# EAGLE design Alice3 (EAGLE 6.5.0)
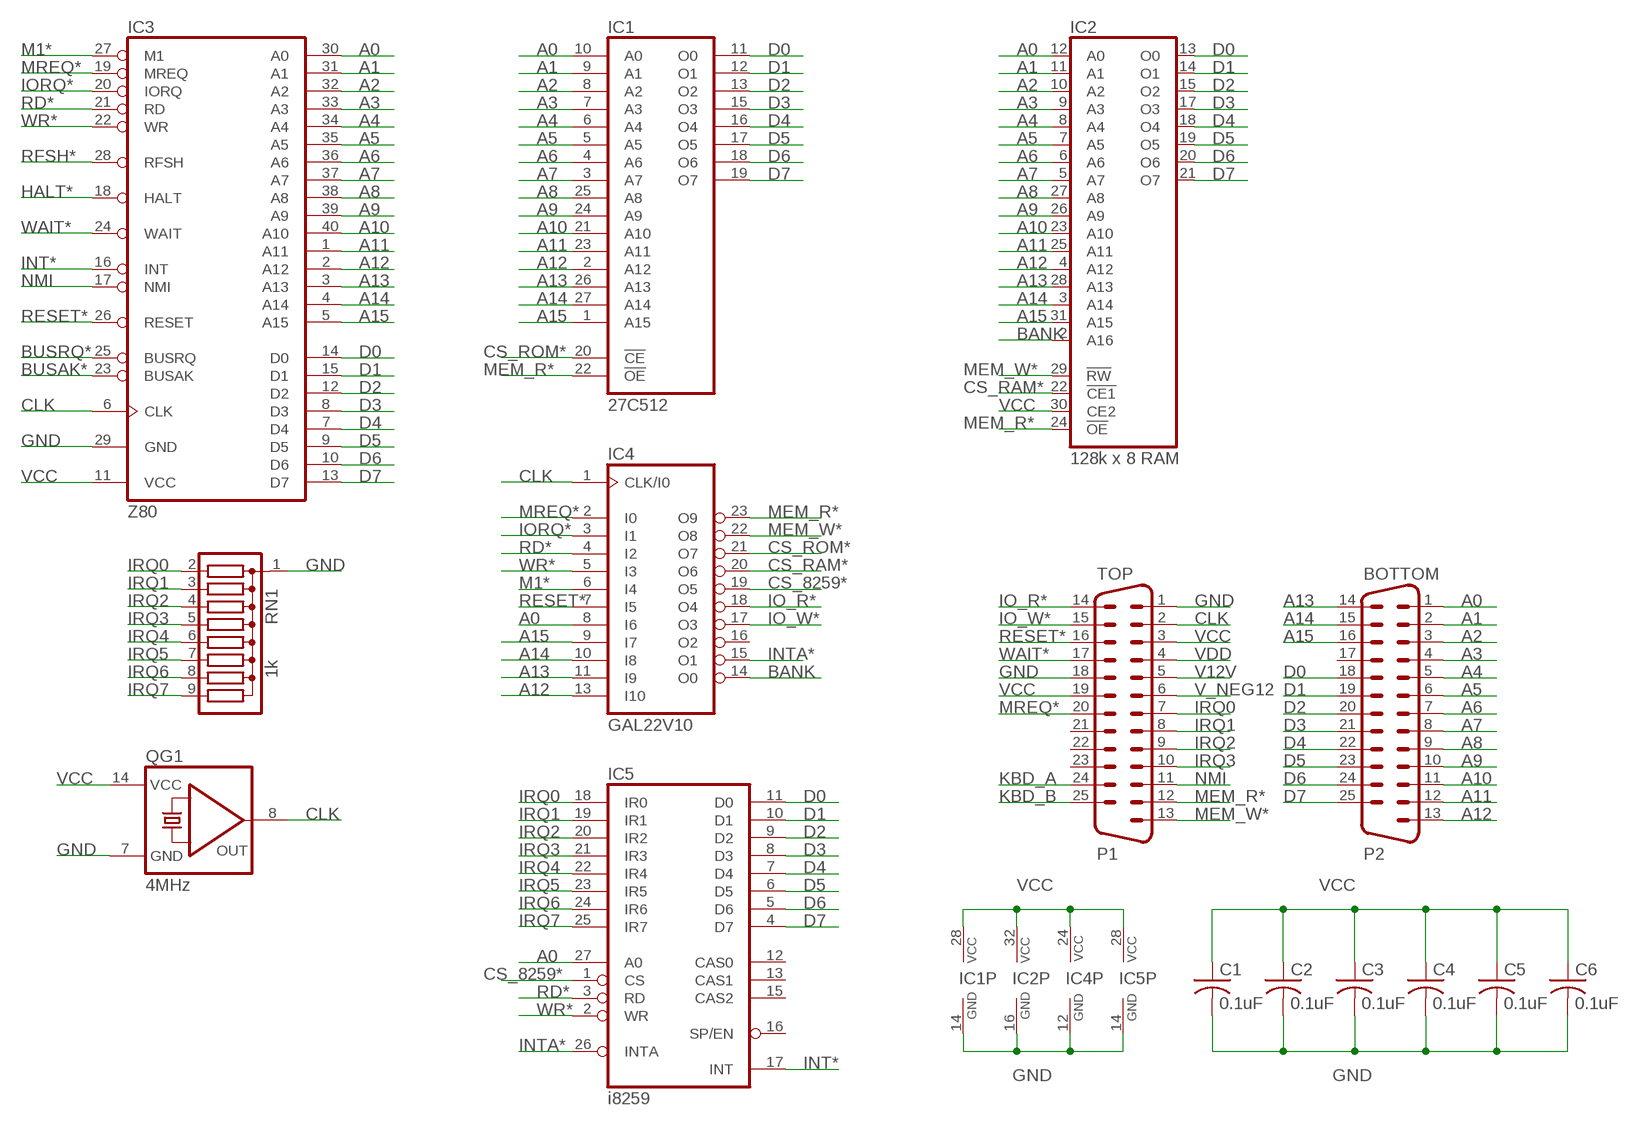
[diagram p0: schematic, sheet 1]

## Parts
BOTTOM  P2  DB25HP  [M25HP]
C1  0.1uF  C-USC1206  [C1206]
C2  0.1uF  C-USC1206  [C1206]
C3  0.1uF  C-USC1206  [C1206]
C4  0.1uF  C-USC1206  [C1206]
C5  0.1uF  C-USC1206  [C1206]
C6  0.1uF  C-USC1206  [C1206]
IC1  27C512  27512  [DIL28]
IC2  128k x 8 RAM  TC551001CP  [DIL32]
IC3  Z80  Z80CPU  [DIL40]
IC4  GAL22V10  22V10  [DIL24-3]
IC5  i8259  8259A  [DIL28-6]
QG1  4MHz  QG5860  [DIL14S]
RN1  1k  G08R  [SIL9]
TOP  P1  DB25HP  [M25HP]

## Nets
A0: BOTTOM.1 IC1.10(A0) IC2.12(A0) IC3.30(A0) IC4.8(I6) IC5.27(A0)
A1: BOTTOM.2 IC1.9(A1) IC2.11(A1) IC3.31(A1)
A2: BOTTOM.3 IC1.8(A2) IC2.10(A2) IC3.32(A2)
A3: BOTTOM.4 IC1.7(A3) IC2.9(A3) IC3.33(A3)
A4: BOTTOM.5 IC1.6(A4) IC2.8(A4) IC3.34(A4)
A5: BOTTOM.6 IC1.5(A5) IC2.7(A5) IC3.35(A5)
A6: BOTTOM.7 IC1.4(A6) IC2.6(A6) IC3.36(A6)
A7: BOTTOM.8 IC1.3(A7) IC2.5(A7) IC3.37(A7)
A8: BOTTOM.9 IC1.25(A8) IC2.27(A8) IC3.38(A8)
A9: BOTTOM.10 IC1.24(A9) IC2.26(A9) IC3.39(A9)
A10: BOTTOM.11 IC1.21(A10) IC2.23(A10) IC3.40(A10)
A11: BOTTOM.12 IC1.23(A11) IC2.25(A11) IC3.1(A11)
A12: BOTTOM.13 IC1.2(A12) IC2.4(A12) IC3.2(A12) IC4.13(I10)
A13: BOTTOM.14 IC1.26(A13) IC2.28(A13) IC3.3(A13) IC4.11(I9)
A14: BOTTOM.15 IC1.27(A14) IC2.3(A14) IC3.4(A14) IC4.10(I8)
A15: BOTTOM.16 IC1.1(A15) IC2.31(A15) IC3.5(A15) IC4.9(I7)
BANK: IC2.2(A16) IC4.14(O0)
BUSAK*: IC3.23(BUSAK)
BUSRQ*: IC3.25(BUSRQ)
CLK: IC3.6(CLK) IC4.1(CLK/I0) QG1.8(OUT) TOP.2
CS_8259*: IC4.19(O5) IC5.1(CS)
CS_RAM*: IC2.22(!CE1) IC4.20(O6)
CS_ROM*: IC1.20(!CE) IC4.21(O7)
D0: BOTTOM.18 IC1.11(O0) IC2.13(O0) IC3.14(D0) IC5.11(D0)
D1: BOTTOM.19 IC1.12(O1) IC2.14(O1) IC3.15(D1) IC5.10(D1)
D2: BOTTOM.20 IC1.13(O2) IC2.15(O2) IC3.12(D2) IC5.9(D2)
D3: BOTTOM.21 IC1.15(O3) IC2.17(O3) IC3.8(D3) IC5.8(D3)
D4: BOTTOM.22 IC1.16(O4) IC2.18(O4) IC3.7(D4) IC5.7(D4)
D5: BOTTOM.23 IC1.17(O5) IC2.19(O5) IC3.9(D5) IC5.6(D5)
D6: BOTTOM.24 IC1.18(O6) IC2.20(O6) IC3.10(D6) IC5.5(D6)
D7: BOTTOM.25 IC1.19(O7) IC2.21(O7) IC3.13(D7) IC5.4(D7)
GND: C1.2 C2.2 C3.2 C4.2 C5.2 C6.2 IC1.14(GND) IC2.16(GND) IC3.29(GND) IC4.12(GND) IC5.14(GND) QG1.7(GND) RN1.1 TOP.1 TOP.18
HALT*: IC3.18(HALT)
INT*: IC3.16(INT) IC5.17(INT)
INTA*: IC4.15(O1) IC5.26(INTA)
IO_R*: IC4.18(O4) TOP.14
IO_W*: IC4.17(O3) TOP.15
IORQ*: IC3.20(IORQ) IC4.3(I1)
IRQ0: IC5.18(IR0) RN1.2 TOP.7
IRQ1: IC5.19(IR1) RN1.3 TOP.8
IRQ2: IC5.20(IR2) RN1.4 TOP.9
IRQ3: IC5.21(IR3) RN1.5 TOP.10
IRQ4: IC5.22(IR4) RN1.6
IRQ5: IC5.23(IR5) RN1.7
IRQ6: IC5.24(IR6) RN1.8
IRQ7: IC5.25(IR7) RN1.9
KBD_A: TOP.24
KBD_B: TOP.25
M1*: IC3.27(M1) IC4.6(I4)
MEM_R*: IC1.22(!OE) IC2.24(!OE) IC4.23(O9) TOP.12
MEM_W*: IC2.29(!RW) IC4.22(O8) TOP.13
MREQ*: IC3.19(MREQ) IC4.2(I0) TOP.20
NMI: IC3.17(NMI) TOP.11
RD*: IC3.21(RD) IC4.4(I2) IC5.3(RD)
RESET*: IC3.26(RESET) IC4.7(I5) TOP.16
RFSH*: IC3.28(RFSH)
V12V: TOP.5
V_NEG12: TOP.6
VCC: C1.1 C2.1 C3.1 C4.1 C5.1 C6.1 IC1.28(VCC) IC2.30(CE2) IC2.32(VCC) IC3.11(VCC) IC4.24(VCC) IC5.28(VCC) QG1.14(VCC) TOP.3 TOP.19
VDD: TOP.4
WAIT*: IC3.24(WAIT) TOP.17
WR*: IC3.22(WR) IC4.5(I3) IC5.2(WR)
Unconnected: BOTTOM.17 IC2.1(NC) IC4.16(O2) IC5.12(CAS0) IC5.13(CAS1) IC5.15(CAS2) IC5.16(SP/EN) TOP.21 TOP.22 TOP.23

## Library data of the parts
BOTTOM TOP = SparkFun-Connectors:DB25: Various DB25 connectors
C1-C6 = resistor:C-US: CAPACITOR, American symbol
IC1 = memory:27512: MEMORY
IC2 = memory:TC551001CP: MEMORY
IC3 = zilog:Z80CPU: Z80 FAMILY DEVICE
IC4 = pal:22V10: PAL; MPN: GAL22V10D-7LPN; OC_FARNELL: 1571925; OC_NEWARK: 97M0480
IC5 = micro-intel:8259A: MICROCOMPUTER/PERIPHERAL DEVICE; OC_FARNELL: unknown; OC_NEWARK: unknown
QG1 = crystal:QG5860: CRYSTAL RESONATOR; OC_FARNELL: unknown; OC_NEWARK: unknown
RN1 = resistor-sil:G08R: SIL RESISTOR; OC_FARNELL: unknown; OC_NEWARK: unknown

## Board
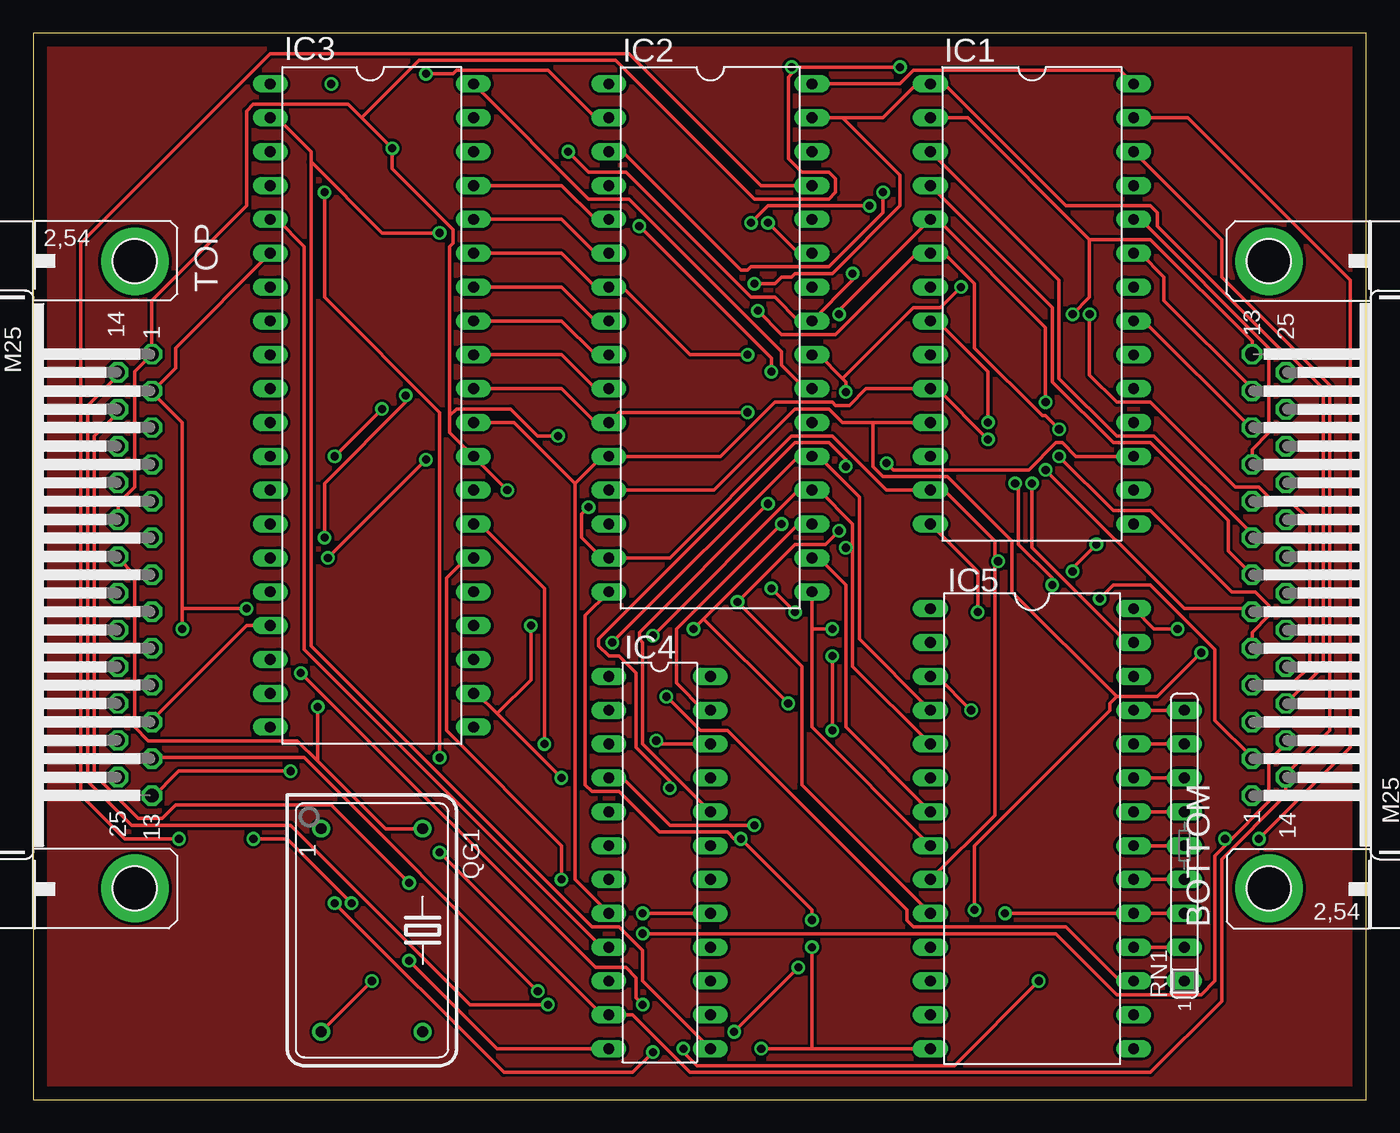
[diagram p1: board, top side]
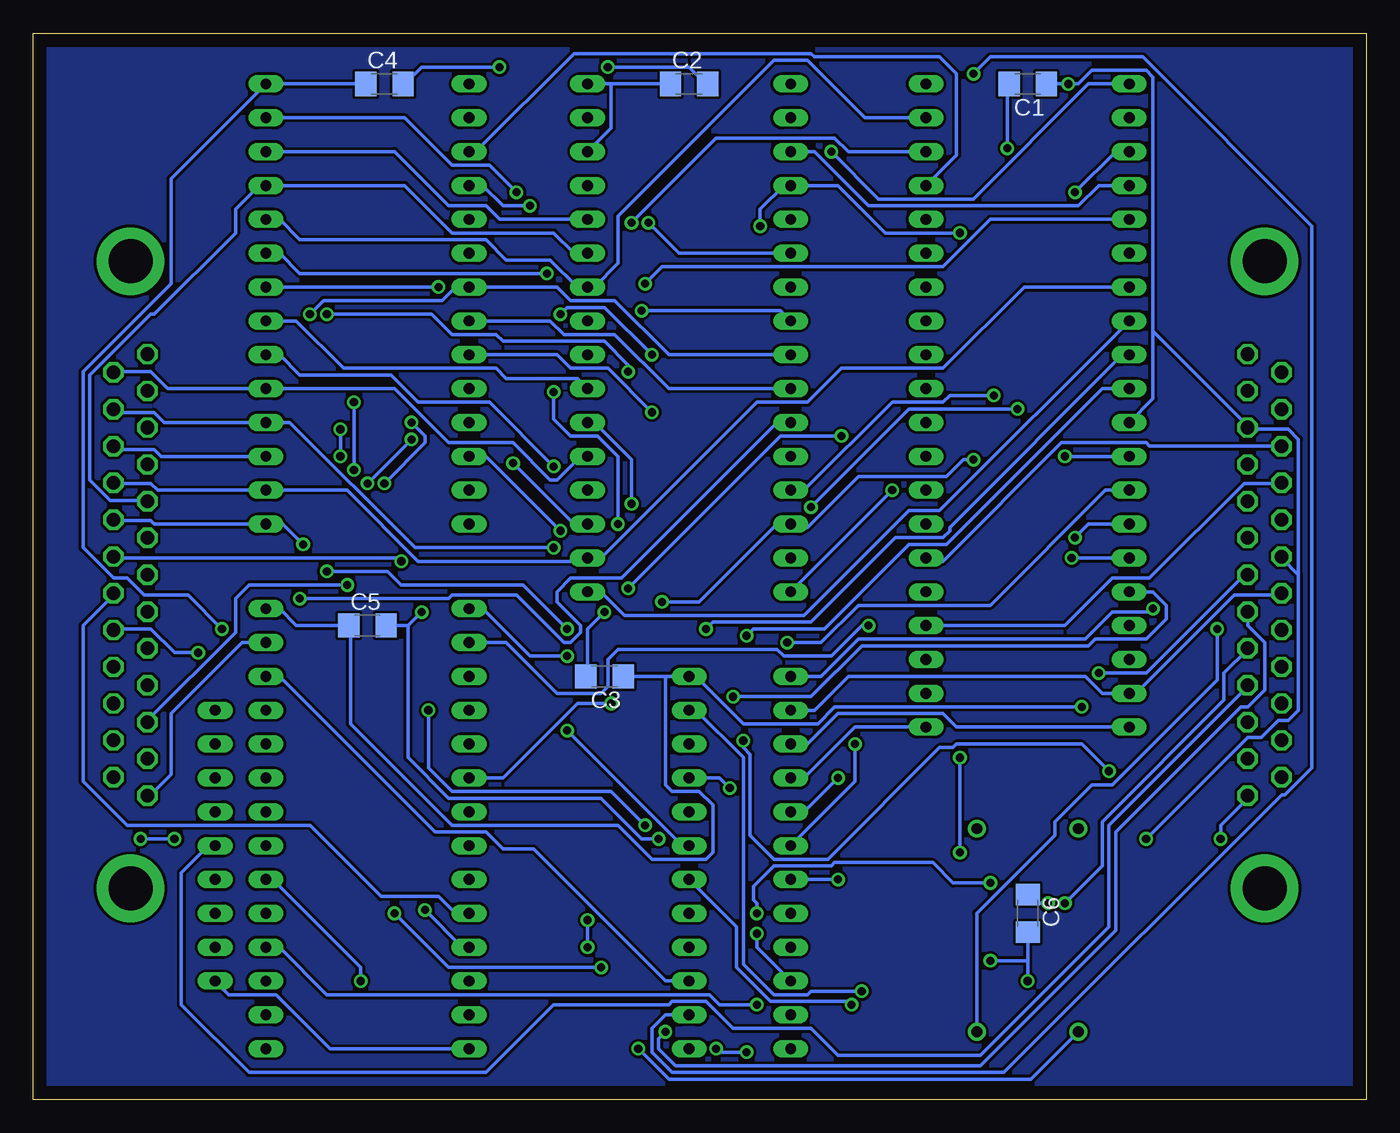
[diagram p2: board, bottom side, seen from below]

Size 100 x 80 mm. Coordinates in mm from the lower left corner, seen from the top.
Outline: 0,0 100,0 100,80 0,80 0,0
Copper layers (1*16): Top 0.035mm / dielectric 1.5mm / Bottom 0.035mm
Design rules "default": minimum track width 10mil, minimum drill 24mil, track to track 8mil, track to pad 8mil, pad to pad 8mil, via to via 8mil, smd to smd 8mil, copper to edge 40mil, drill to drill 8mil, minimum pad ring 10mil, minimum via ring 8mil, stop-mask expansion 4mil, vias tented up to drill 0mil, thermal gap 10mil

### Footprints (pad centres in the part's own frame; a part is rotated, then mirrored left to right if it is on the bottom)
M25HP = drill 1.016 octagon: 1 -16.561,1.27; 2 -13.792,1.27; 3 -11.049,1.27; 4 -8.28,1.27; 5 -5.512,1.27; 6 -2.769,1.27; 7 0,1.27; 8 2.769,1.27; 9 5.512,1.27; 10 8.28,1.27; 11 11.049,1.27; 12 13.792,1.27; 13 16.561,1.27; 14 -15.189,-1.27; 15 -12.421,-1.27; 16 -9.652,-1.27; 17 -6.909,-1.27; 18 -4.14,-1.27; 19 -1.372,-1.27; 20 1.372,-1.27; 21 4.14,-1.27; 22 6.909,-1.27; 23 9.652,-1.27; 24 12.421,-1.27; 25 15.189,-1.27 | drill 3.302 pad 5.08: G1 -23.52,0; G2 23.52,0
C1206 = smd 1.6 x 1.8: 1 -1.4,0; 2 1.4,0
DIL28 = drill 0.813 long: 1 -16.51,-7.62; 2 -13.97,-7.62; 3 -11.43,-7.62; 4 -8.89,-7.62; 5 -6.35,-7.62; 6 -3.81,-7.62; 7 -1.27,-7.62; 8 1.27,-7.62; 9 3.81,-7.62; 10 6.35,-7.62; 11 8.89,-7.62; 12 11.43,-7.62; 13 13.97,-7.62; 14 16.51,-7.62; 15 16.51,7.62; 16 13.97,7.62; 17 11.43,7.62; 18 8.89,7.62; 19 6.35,7.62; 20 3.81,7.62; 21 1.27,7.62; 22 -1.27,7.62; 23 -3.81,7.62; 24 -6.35,7.62; 25 -8.89,7.62; 26 -11.43,7.62; 27 -13.97,7.62; 28 -16.51,7.62
DIL32 = drill 0.813 long: 1 -19.05,-7.62; 2 -16.51,-7.62; 3 -13.97,-7.62; 4 -11.43,-7.62; 5 -8.89,-7.62; 6 -6.35,-7.62; 7 -3.81,-7.62; 8 -1.27,-7.62; 9 1.27,-7.62; 10 3.81,-7.62; 11 6.35,-7.62; 12 8.89,-7.62; 13 11.43,-7.62; 14 13.97,-7.62; 15 16.51,-7.62; 16 19.05,-7.62; 17 19.05,7.62; 18 16.51,7.62; 19 13.97,7.62; 20 11.43,7.62; 21 8.89,7.62; 22 6.35,7.62; 23 3.81,7.62; 24 1.27,7.62; 25 -1.27,7.62; 26 -3.81,7.62; 27 -6.35,7.62; 28 -8.89,7.62; 29 -11.43,7.62; 30 -13.97,7.62; 31 -16.51,7.62; 32 -19.05,7.62
DIL40 = drill 0.813 long: 1 -24.13,-7.62; 2 -21.59,-7.62; 3 -19.05,-7.62; 4 -16.51,-7.62; 5 -13.97,-7.62; 6 -11.43,-7.62; 7 -8.89,-7.62; 8 -6.35,-7.62; 9 -3.81,-7.62; 10 -1.27,-7.62; 11 1.27,-7.62; 12 3.81,-7.62; 13 6.35,-7.62; 14 8.89,-7.62; 15 11.43,-7.62; 16 13.97,-7.62; 17 16.51,-7.62; 18 19.05,-7.62; 19 21.59,-7.62; 20 24.13,-7.62; 21 24.13,7.62; 22 21.59,7.62; 23 19.05,7.62; 24 16.51,7.62; 25 13.97,7.62; 26 11.43,7.62; 27 8.89,7.62; 28 6.35,7.62; 29 3.81,7.62; 30 1.27,7.62; 31 -1.27,7.62; 32 -3.81,7.62; 33 -6.35,7.62; 34 -8.89,7.62; 35 -11.43,7.62; 36 -13.97,7.62; 37 -16.51,7.62; 38 -19.05,7.62; 39 -21.59,7.62; 40 -24.13,7.62
DIL24-3 = drill 0.813 long: 1 -13.97,-3.81; 2 -11.43,-3.81; 3 -8.89,-3.81; 4 -6.35,-3.81; 5 -3.81,-3.81; 6 -1.27,-3.81; 7 1.27,-3.81; 8 3.81,-3.81; 9 6.35,-3.81; 10 8.89,-3.81; 11 11.43,-3.81; 12 13.97,-3.81; 13 13.97,3.81; 14 11.43,3.81; 15 8.89,3.81; 16 6.35,3.81; 17 3.81,3.81; 18 1.27,3.81; 19 -1.27,3.81; 20 -3.81,3.81; 21 -6.35,3.81; 22 -8.89,3.81; 23 -11.43,3.81; 24 -13.97,3.81
DIL28-6 = drill 0.813 long: 1 -16.51,-7.62; 2 -13.97,-7.62; 3 -11.43,-7.62; 4 -8.89,-7.62; 5 -6.35,-7.62; 6 -3.81,-7.62; 7 -1.27,-7.62; 8 1.27,-7.62; 9 3.81,-7.62; 10 6.35,-7.62; 11 8.89,-7.62; 12 11.43,-7.62; 13 13.97,-7.62; 14 16.51,-7.62; 15 16.51,7.62; 16 13.97,7.62; 17 11.43,7.62; 18 8.89,7.62; 19 6.35,7.62; 20 3.81,7.62; 21 1.27,7.62; 22 -1.27,7.62; 23 -3.81,7.62; 24 -6.35,7.62; 25 -8.89,7.62; 26 -11.43,7.62; 27 -13.97,7.62; 28 -16.51,7.62
DIL14S = drill 0.813: 1 -7.62,-3.81; 7 7.62,-3.81; 8 7.62,3.81; 14 -7.62,3.81
SIL9 = drill 0.813 long: 1 -10.16,0; 2 -7.62,0; 3 -5.08,0; 4 -2.54,0; 5 0,0; 6 2.54,0; 7 5.08,0; 8 7.62,0; 9 10.16,0

### Placement (x,y rotation side)
BOTTOM  92.71,39.37 90 top
C1  25.4,76.2 180 bottom
C2  50.8,76.2 0 bottom
C3  57.15,31.75 180 bottom
C4  73.66,76.2 0 bottom
C5  74.93,35.56 0 bottom
C6  25.4,13.97 270 bottom
IC1  74.93,59.69 270 top
IC2  50.8,57.15 270 top
IC3  25.4,52.07 270 top
IC4  46.99,17.78 270 top
IC5  74.93,20.32 270 top
QG1  25.4,12.7 270 top
RN1  86.36,19.05 90 top
TOP  7.62,39.37 270 top

### Tracks (layer width: path | path; a pad name or v marks a point on that pad's centre or on a via)
A0  (via drill 0.61)
  Top 0.254: IC4.8 40.64,16.51 40.64,46.23 | 40.64,46.23 42.67,48.26 IC2.12 51.56,48.26 55.63,52.32 59.94,52.32 60.2,52.07 61.21,52.07 62.48,53.34 IC1.10 67.82,53.34 v71.63,49.53 | IC3.30 36.07,50.8 40.64,46.23 | IC5.27 82.04,34.29 74.93,41.4 v74.93,46.23
  Bottom 0.254: IC5.27 84.33,34.29 89.66,28.96 89.66,24.38 91.44,22.61 BOTTOM.1 | v71.63,49.53 v74.93,46.23
A1  (via drill 0.61)
  Top 0.254: IC3.31 39.62,53.34 42.16,50.8 IC2.11 43.94,51.56 v53.59,51.56 | v80.01,37.59 81.03,38.61 83.82,38.61 88.65,33.78 88.65,28.45 91.44,25.65 BOTTOM.2
  Bottom 0.254: IC1.9 60.71,55.88 59.69,54.86 56.9,54.86 v53.59,51.56 | v80.01,37.59 68.83,37.59 68.58,37.85 63.75,37.85 60.2,34.29 59.69,34.29 58.93,35.05 58.93,35.56 60.71,37.34 60.71,38.1 59.69,39.12 55.88,39.12 44.2,50.8 IC2.11
A2  (via drill 0.61)
  Top 0.254: IC3.32 39.62,55.88 42.16,53.34 IC2.10 | v76.45,38.61 76.45,39.12 73.91,41.66 73.91,45.97 v73.66,46.23 | v71.63,50.8 71.63,54.61 67.82,58.42 IC1.8
  Bottom 0.254: IC1.8 61.21,58.42 60.2,57.4 56.39,57.4 52.32,53.34 IC2.10 | v76.45,38.61 83.82,38.61 84.84,37.59 84.84,35.05 91.44,28.45 BOTTOM.3 | v73.66,46.23 70.61,49.28 70.61,49.78 v71.63,50.8
A3  (via drill 0.61)
  Top 0.254: IC3.33 39.62,58.42 42.16,55.88 IC2.9 | v79.25,58.93 79.25,54.36 81.28,52.32 83.82,52.32 90.17,45.97 91.95,45.97 92.96,44.96 94.23,44.96 95.76,43.43 95.76,32.51 94.49,31.24 91.44,31.24 BOTTOM.4
  Bottom 0.254: IC2.9 52.32,55.88 56.39,59.94 59.69,59.94 60.71,60.96 IC1.7 68.33,60.96 69.34,59.94 78.23,59.94 v79.25,58.93
A4  (via drill 0.61)
  Top 0.254: IC3.34 39.62,60.96 42.16,58.42 IC2.8 | v54.36,59.18 56.13,57.4 60.2,57.4 66.29,63.5 IC1.6 68.33,63.5 70.61,61.21 70.61,56.39 75.69,51.31 75.95,51.31 v76.96,50.29 | v76.96,48.26 81.03,44.2 83.82,44.2 89.92,38.1 91.69,38.1 92.71,37.08 92.71,36.32 91.44,35.05 91.44,34.04 BOTTOM.5
  Bottom 0.254: v54.36,59.18 43.94,59.18 IC2.8 | v76.96,50.29 v76.96,48.26
A5  (via drill 0.61)
  Top 0.254: IC3.35 39.62,63.5 42.16,60.96 IC2.7 44.2,60.96 49.28,55.88 v53.59,55.88 | v60.45,58.93 60.45,59.18 IC1.5 67.82,66.04 75.95,57.91 v75.95,52.32 | v75.95,47.24 86.36,36.83 91.44,36.83 BOTTOM.6
  Bottom 0.254: v60.45,58.93 59.94,59.44 57.15,59.44 v53.59,55.88 | v75.95,52.32 v75.95,47.24
A6  (via drill 0.61)
  Top 0.254: IC3.36 39.62,66.04 42.16,63.5 IC2.6 | IC1.4 76.45,59.44 76.45,53.85 81.03,49.28 83.82,49.28 89.66,43.43 89.66,41.15 BOTTOM.7 | v53.85,65.79 55.12,67.06 v62.74,67.06
  Bottom 0.254: IC2.6 51.56,63.5 v53.85,65.79 | v62.74,67.06 64.77,67.06 66.29,68.58 IC1.4
A7
  Top 0.254: IC3.37 39.62,68.58 42.16,66.04 IC2.5 | IC1.3 76.96,61.47 76.96,54.1 81.28,49.78 84.07,49.78 91.44,42.42 91.44,42.16 BOTTOM.8
  Bottom 0.254: IC3.37 30.73,70.87 30.73,76.96 32,78.23 41.4,78.23 41.66,78.49 59.44,78.49 66.8,71.12 IC1.3
A8  (via drill 0.61)
  Top 0.254: v55.12,65.79 57.4,63.5 IC2.27
  Bottom 0.254: IC3.38 38.86,71.12 39.88,72.14 48.77,72.14 v55.12,65.79 | IC2.27 59.44,63.5 60.96,65.02 68.58,65.02 72.14,68.58 IC1.25 83.06,68.58 84.84,66.8 84.84,65.02 90.93,58.93 91.19,58.93 95.76,54.36 95.76,46.48 94.23,44.96 91.44,44.96 BOTTOM.9
A9
  Top 0.254: IC1.24 83.06,66.04 92.71,56.39 92.71,50.04 91.44,48.77 91.44,47.75 BOTTOM.10
  Bottom 0.254: IC1.24 81.53,66.04 80.01,64.52 66.04,64.52 64.52,62.99 61.21,62.99 59.18,60.96 IC2.26 57.91,60.96 56.13,62.74 56.13,66.29 44.45,77.98 41.91,77.98 37.59,73.66 IC3.39
A10
  Top 0.254: IC1.21 83.31,58.42 91.44,50.29 BOTTOM.11 | IC3.40 41.66,67.56 44.7,67.56 56.13,56.13 56.13,55.12 57.91,53.34 IC2.23
  Bottom 0.254: IC1.21 80.26,58.42 76.71,54.86 65.28,54.86 64.52,54.1 59.18,54.1 IC2.23
A11  (via drill 0.61)
  Top 0.254: v61.47,61.98 61.47,61.47 IC2.25 57.4,58.42 55.63,60.2 53.85,60.2 44.45,69.6 41.66,69.6 v40.13,71.12 | IC1.23 83.06,63.5 84.84,61.72 84.84,59.94 91.44,53.34 BOTTOM.12
  Bottom 0.254: v61.47,61.98 80.01,61.98 81.53,63.5 IC1.23 | IC3.1 20.83,76.2 29.46,67.56 36.58,67.56 v40.13,71.12
A12  (via drill 0.61)
  Top 0.254: IC1.2 70.1,73.66 79.25,64.52 | 79.25,64.52 83.82,64.52 91.44,56.9 91.44,56.13 BOTTOM.13 | IC4.13 45.72,8.89 45.72,11.18 43.94,12.95 41.91,12.95 20.83,34.04 20.83,70.36 | 20.83,70.36 20.83,71.12 18.29,73.66 IC3.2 | v30.48,65.02 26.16,65.02 20.83,70.36 | 79.25,64.52 79.25,60.2 v77.98,58.93 | v55.37,54.61 55.37,55.63 v45.47,65.53
  Bottom 0.254: v30.48,65.02 36.07,65.02 39.62,68.58 IC2.4 43.69,68.58 45.47,66.8 v45.47,65.53 | v77.98,58.93 70.1,58.93 68.58,57.4 65.28,57.4 64.77,56.9 57.15,56.9 55.37,55.12 v55.37,54.61
A13  (via drill 0.61)
  Top 0.254: v21.84,68.07 21.84,60.2 30.48,51.56 v30.48,25.65 | v30.48,18.54 42.67,6.35 IC4.11 44.96,6.35 49.28,2.03 83.82,2.03 89.15,7.37 89.15,18.03 93.98,22.86 93.98,24.13 BOTTOM.14 93.98,24.38 97.28,27.69 97.28,53.59 89.15,61.72 89.15,64.52 IC1.26
  Bottom 0.254: IC2.28 65.02,66.04 66.04,67.06 68.83,67.06 72.9,71.12 IC1.26 | IC3.3 18.8,71.12 v21.84,68.07 | v30.48,18.54 v30.48,25.65
A14  (via drill 0.61)
  Top 0.254: v45.72,12.45 76.71,12.45 81.28,7.87 87.63,7.87 88.65,8.89 88.65,18.29 89.66,19.3 | 89.66,19.3 92.71,22.35 92.71,25.4 93.98,26.67 93.98,26.92 BOTTOM.15 | v63.75,68.07 63.75,66.55 59.69,62.48 53.85,62.48 53.59,62.23 53.09,62.23 44.2,71.12 IC2.3 | v89.41,19.56 89.66,19.3 | v91.95,19.56 98.81,26.42 98.81,61.47 86.61,73.66 IC1.27
  Bottom 0.254: IC4.10 45.72,11.43 v45.72,12.45 | IC3.4 20.07,68.58 21.59,67.06 37.34,67.06 41.4,71.12 IC2.3 | IC1.27 72.14,73.66 68.58,70.1 65.79,70.1 v63.75,68.07 | v91.95,19.56 v89.41,19.56
A15  (via drill 0.61)
  Top 0.254: IC4.9 42.67,11.43 20.32,33.78 20.32,64.01 18.29,66.04 IC3.5 | 60.71,73.66 63.75,73.66 66.29,76.2 IC1.1 68.33,76.2 77.47,67.06 83.82,67.06 84.33,66.55 84.33,65.53 93.98,55.88 94.23,55.88 96.77,53.34 96.77,32.51 BOTTOM.16 | 60.71,73.66 IC2.31 | v54.1,61.21 55.63,61.21 56.13,61.72 56.9,61.72 57.15,61.98 59.94,61.98 65.02,67.06 65.02,69.34 60.71,73.66
  Bottom 0.254: IC3.5 28.19,66.04 31.75,62.48 52.83,62.48 v54.1,61.21
BANK  (via drill 0.61)
  Top 0.254: v29.46,76.96 31.5,76.96 31.75,77.22 38.61,77.22 42.16,73.66 IC2.2
  Bottom 0.254: IC4.14 52.58,6.35 53.59,5.33 53.59,3.56 52.07,2.03 27.18,2.03 6.35,22.86 6.1,22.86 4.06,24.89 4.06,65.53 16.76,78.23 28.19,78.23 v29.46,76.96
CLK  (via drill 0.61)
  Top 0.254: 11.18,36.83 11.18,50.8 8.89,53.09 | 11.18,36.83 v11.18,35.31 | 8.89,53.09 TOP.2 8.89,53.09 | 11.18,36.83 v16,36.83 | IC3.6 10.67,56.39 10.67,54.86 8.89,53.09
  Bottom 0.254: QG1.8 29.21,13.97 23.37,19.81 23.37,20.83 20.57,23.62 19.05,23.62 11.18,31.5 v11.18,35.31 | IC4.1 40.89,31.75 38.1,34.54 21.08,34.54 19.05,36.58 16.26,36.58 v16,36.83
CS_8259*  (via drill 0.61)
  Top 0.254: v59.94,33.27 v59.94,27.69
  Bottom 0.254: IC4.19 51.31,19.05 v59.94,27.69 | v59.94,33.27 62.74,33.27 66.29,36.83 IC5.1
CS_RAM*  (via drill 0.61)
  Top 0.254: IC4.20 45.72,26.67 45.72,34.29 45.47,34.54 45.47,35.05 v55.12,44.7
  Bottom 0.254: v55.12,44.7 55.12,48.01 57.91,50.8 IC2.22
CS_ROM*  (via drill 0.61)
  Top 0.254: v47.75,23.37 47.75,23.88 45.21,26.42 45.21,32 43.94,33.27 43.18,33.27 42.42,34.04 42.42,34.54 57.15,49.28 59.69,49.28 60.96,48.01 v60.96,47.5
  Bottom 0.254: IC4.21 48.51,24.13 v47.75,23.37 | v60.96,47.5 65.79,52.32 71.12,52.32 73.15,54.36 80.01,54.36 81.53,55.88 IC1.20
D0  (via drill 0.61)
  Top 0.254: v70.61,14.22 70.61,19.05 80.77,29.21 80.77,29.72 81.28,30.23 | 81.28,30.23 84.33,30.23 v87.63,33.53 | v21.84,42.16 21.84,46.23 27.94,52.32 v27.94,52.83 | 62.99,50.8 60.71,50.8 59.69,51.82 57.15,51.82 51.05,45.72 IC2.13 | 62.99,50.8 IC1.11 | 81.28,30.23 73.41,38.1 73.41,41.91 68.58,46.74 63.75,46.74 62.99,47.5 62.99,50.8
  Bottom 0.254: IC5.11 67.82,11.43 v70.61,14.22 | v87.63,33.53 89.41,33.53 91.19,35.31 93.98,35.31 BOTTOM.18 | IC3.14 20.83,43.18 v21.84,42.16 | v27.94,52.83 31.24,52.83 31.75,52.32 35.56,52.32 42.16,45.72 IC2.13
D1  (via drill 0.61)
  Top 0.254: v29.46,48.01 v22.1,40.64 | IC5.10 57.66,23.62 57.66,32.51 v52.83,37.34 57.15,41.66 59.44,41.66 v60.45,42.67
  Bottom 0.254: v22.1,40.64 IC3.15 | v29.46,48.01 30.23,48.01 31.5,46.74 38.1,46.74 41.91,42.93 42.93,42.93 IC2.14 44.2,43.18 50.04,37.34 v52.83,37.34 | IC1.12 66.04,48.26 v60.45,42.67 | IC5.10 68.33,13.97 69.6,15.24 73.91,15.24 79.25,20.57 92.96,20.57 96.27,23.88 96.27,35.56 93.98,37.85 BOTTOM.19
D2  (via drill 0.61)
  Top 0.254: IC5.9 72.14,21.34 72.14,40.39 | 72.14,40.39 72.14,41.91 68.33,45.72 IC1.13 64.01,45.72 59.94,49.78 56.9,49.78 47.75,40.64 IC2.15 42.67,40.64 41.15,42.16 41.15,43.94 v41.66,44.45 | v26.16,51.82 v22.61,48.26 | 72.14,40.39 v72.39,40.39
  Bottom 0.254: v22.61,48.26 IC3.12 | v26.16,51.82 34.29,51.82 v41.66,44.45 | v72.39,40.39 72.64,40.64 93.98,40.64 BOTTOM.20
D3  (via drill 0.61)
  Top 0.254: IC5.8 58.42,27.94 58.42,35.31 | IC2.17 58.42,35.31 | v79.76,41.66 77.98,39.88 v77.98,39.62 | 58.42,35.31 v59.94,35.31
  Bottom 0.254: BOTTOM.21 93.98,43.43 91.19,43.43 90.93,43.18 IC1.15 81.28,43.18 v79.76,41.66 | IC3.8 32,44.2 34.29,44.2 42.16,36.32 55.63,36.32 57.4,38.1 IC2.17 | v77.98,39.62 73.41,39.62 72.39,38.61 63.25,38.61 v59.94,35.31
D4
  Top 0.254: IC5.7 60.96,27.94 60.96,38.61 58.93,40.64 IC2.18
  Bottom 0.254: BOTTOM.22 93.98,46.23 91.19,46.23 90.68,45.72 IC1.16 76.45,45.72 71.12,40.39 58.67,40.39 IC2.18 57.4,40.64 45.72,52.32 41.91,52.32 39.37,54.86 31.75,54.86 25.65,60.96 IC3.7
D5  (via drill 0.61)
  Top 0.254: 50.29,36.07 57.4,43.18 IC2.19 | 50.29,36.07 v49.53,35.31 | 50.29,36.07 v56.64,29.72 | IC1.17 78.23,48.26 77.22,49.28 76.71,49.28 74.68,47.24 64.52,47.24 v64.01,47.75
  Bottom 0.254: IC1.17 90.42,48.26 90.93,48.77 93.73,48.77 BOTTOM.23 | IC3.9 18.29,55.88 31.24,42.93 31.24,42.67 31.75,42.16 35.31,42.16 41.66,35.81 49.02,35.81 v49.53,35.31 | IC5.6 64.77,24.13 59.18,29.72 v56.64,29.72 | v64.01,47.75 59.44,43.18 IC2.19
D6  (via drill 0.61)
  Top 0.254: v46.48,34.8 57.4,45.72 IC2.20 58.93,45.72 61.47,43.18 61.47,41.4 | IC5.5 61.47,32.51 61.47,41.4 | 61.47,41.4 v60.96,41.4
  Bottom 0.254: BOTTOM.24 93.98,51.56 90.93,51.56 90.17,50.8 IC1.18 80.77,50.8 71.37,41.4 v60.96,41.4 | IC3.10 19.81,53.34 31.5,41.66 34.29,41.66 40.64,35.31 45.97,35.31 v46.48,34.8
D7  (via drill 0.61)
  Top 0.254: v43.43,34.29 57.4,48.26 IC2.21 58.93,48.26 61.98,45.21 61.98,34.54 IC5.4
  Bottom 0.254: BOTTOM.25 93.98,54.61 91.19,54.61 89.92,53.34 IC1.19 72.9,53.34 68.83,49.28 64.01,49.28 61.21,46.48 60.71,46.48 58.93,48.26 IC2.21 | IC3.13 19.56,45.72 28.19,37.08 38.1,37.08 40.89,34.29 v43.43,34.29
GND  (via drill 0.61)
  Top 0.254: QG1.7 v25.4,8.89 | IC4.12 34.8,3.81 v28.19,10.41 | v54.61,3.81 58.42,3.81 | 58.42,3.81 IC5.14 | v65.02,77.47 v56.9,77.47 56.9,76.96 56.64,76.71 56.64,70.61 57.66,69.6 59.69,69.6 60.2,69.09 60.2,68.07 59.69,67.56 54.1,67.56 43.69,77.98 28.96,77.98 24.64,73.66 | TOP.18 6.35,43.69 6.35,44.7 7.62,45.97 7.62,54.61 8.89,55.88 TOP.1 8.89,56.13 8.89,59.94 16,67.06 16,74.17 16.51,74.68 23.62,74.68 24.64,73.66 | v70.87,36.58 70.87,39.62 IC1.14 | v55.37,38.35 v57.15,36.58 | v39.37,49.78 37.85,49.78 35.81,51.82 31.75,51.82 31.24,51.31 | 31.24,51.31 31.24,50.04 IC3.29 v35.56,45.72 | 31.24,51.31 31.24,64.01 31.5,64.26 31.5,65.28 26.92,69.85 v26.92,71.37 24.64,73.66 | IC2.16 41.4,36.32 41.4,23.62 41.91,23.11 43.94,23.11 46.99,20.07 52.07,20.07 52.58,19.56 v53.09,19.56 58.42,14.22 v58.42,13.46 | v58.42,11.43 58.42,3.81
  Bottom 0.254: IC5.14 77.72,3.81 81.79,7.87 85.34,7.87 RN1.1 | v25.4,8.89 25.4,10.41 | 25.4,10.41 25.4,12.45 C6.2 | 25.4,10.41 v28.19,10.41 | v54.61,3.81 52.32,1.52 25.15,1.52 QG1.7 | v56.9,77.47 50.8,77.47 49.53,76.2 C2.2 | v65.02,77.47 70.87,77.47 72.14,76.2 C4.2 | 71.88,35.56 73.41,35.56 C5.2 | v70.87,36.58 71.88,35.56 | v57.15,36.58 58.42,35.31 58.42,31.75 C3.2 | v55.37,38.35 43.94,49.78 v39.37,49.78 | v26.92,71.37 26.92,76.2 C1.2 | v35.56,45.72 IC2.16 | 71.88,35.56 71.88,25.65 68.83,22.61 57.4,22.61 54.36,19.56 v53.09,19.56 | v58.42,13.46 v58.42,11.43 | IC4.12
INT*  (via drill 0.61)
  Top 0.254: v47.5,30.23 50.04,27.69 52.07,27.69 65.53,14.22 65.53,13.46 66.04,12.95 77.47,12.95 81.53,8.89 IC5.17
  Bottom 0.254: IC3.16 16,38.1 14.99,37.08 14.99,36.07 16.51,34.54 20.32,34.54 20.83,34.04 37.85,34.04 41.66,30.23 v47.5,30.23
INTA*
  Bottom 0.254: IC4.15 52.58,8.89 62.48,18.8 64.77,18.8 66.04,20.07 69.85,20.07 81.53,31.75 IC5.26
IO_R*  (via drill 0.61)
  Top 0.254: v38.61,7.11 32.77,7.11 19.3,20.57 7.37,20.57 4.06,23.88 4.06,52.07 6.35,54.36 TOP.14
  Bottom 0.254: IC4.18 47.24,12.95 47.24,9.91 44.7,7.37 38.86,7.37 v38.61,7.11
IO_W*  (via drill 0.61)
  Top 0.254: v45.72,13.97 IC4.17 | v28.19,16.26 22.35,22.1 10.67,22.1 9.65,21.08 7.87,21.08 4.57,24.38 4.57,49.78 6.35,51.56 TOP.15
  Bottom 0.254: v45.72,13.97 45.72,14.73 45.97,14.99 45.97,16 44.45,17.53 40.13,17.53 39.88,17.78 32.51,17.78 30.99,16.26 v28.19,16.26
IORQ*
  Bottom 0.254: IC3.20 30.73,27.94 31.75,28.96 39.62,28.96 41.91,26.67 IC4.3
IRQ0  (via drill 0.61)
  Top 0.254: RN1.2 IC5.18 | v20.07,32 42.16,9.91 44.45,9.91 45.21,9.14 45.21,7.62 v45.72,7.11
  Bottom 0.254: TOP.7 9.14,39.37 16.51,32 v20.07,32 | v45.72,7.11 48.51,7.11 49.28,7.87 77.98,7.87 81.53,11.43 IC5.18
IRQ1  (via drill 0.61)
  Top 0.254: RN1.3 IC5.19 v72.9,13.97 | v57.4,9.91 v52.58,5.08
  Bottom 0.254: v52.58,5.08 53.09,4.57 53.09,3.81 51.82,2.54 28.96,2.54 18.8,12.7 18.8,20.07 9.4,29.46 8.89,29.46 7.62,30.73 7.62,34.29 8.89,35.56 8.89,36.58 TOP.8 | v57.4,9.91 68.83,9.91 v72.9,13.97
IRQ2  (via drill 0.61)
  Top 0.254: RN1.4 IC5.20 | v22.61,14.73 35.31,2.03 44.96,2.03 v46.48,3.56 | v48.77,3.81 48.77,3.56 49.78,2.54 69.09,2.54 v75.44,8.89
  Bottom 0.254: v22.61,14.73 19.81,17.53 19.81,20.83 10.67,29.97 10.67,32 8.89,33.78 TOP.9 | v46.48,3.56 48.51,3.56 v48.77,3.81 | v75.44,8.89 75.44,9.91 82.04,16.51 IC5.20
IRQ3
  Top 0.254: RN1.5 IC5.21
  Bottom 0.254: RN1.5 86.87,19.05 88.9,17.02 88.9,7.11 83.82,2.03 66.04,2.03 60.96,7.11 52.32,7.11 52.07,7.37 49.53,7.37 47.5,5.33 41.66,5.33 39.62,3.3 28.96,3.3 19.3,12.95 19.3,20.57 8.89,30.99 TOP.10
IRQ4
  Top 0.254: RN1.6 IC5.22
IRQ5
  Top 0.254: RN1.7 IC5.23
IRQ6
  Top 0.254: RN1.8 IC5.24
IRQ7
  Top 0.254: RN1.9 IC5.25
M1*  (via drill 0.61)
  Top 0.254: v38.35,26.67 38.35,38.35 33.53,43.18 IC3.27
  Bottom 0.254: IC4.6 38.35,23.88 v38.35,26.67
MEM_R*  (via drill 0.61)
  Top 0.254: IC4.23 50.29,29.21 48.26,31.24 48.26,35.31 v56.13,43.18 | v60.96,53.09 60.96,53.85 60.71,54.1 | 60.71,54.1 58.93,55.88 IC2.24 | v69.6,60.96 68.07,59.44 66.04,59.44 60.71,54.1 | v37.85,8.13 20.32,25.65 8.89,25.65 TOP.12
  Bottom 0.254: v56.13,43.18 56.13,48.26 57.66,49.78 59.69,49.78 60.96,51.05 v60.96,53.09 | v69.6,60.96 IC1.22 | v37.85,8.13 41.66,8.13 41.91,7.87 44.45,7.87 46.74,10.16 46.74,25.65 50.29,29.21 IC4.23
MEM_W*  (via drill 0.61)
  Top 0.254: IC4.22 46.99,26.67 v46.74,26.92 | v19.3,24.64 10.92,24.64 8.89,22.61 TOP.13 | IC2.29 54.61,68.58 44.7,78.49 17.78,78.49 3.56,64.26 3.56,22.86 6.86,19.56 v10.92,19.56
  Bottom 0.254: v46.74,26.92 46.74,26.42 46.23,25.91 46.23,19.81 44.45,18.03 40.39,18.03 32,26.42 30.99,26.42 30.73,26.67 21.34,26.67 v19.3,24.64 | v10.92,19.56 10.92,20.57 8.89,22.61 TOP.13
MREQ*
  Bottom 0.254: TOP.20 6.35,37.85 9.91,37.85 17.27,30.48 IC3.19 19.81,30.48 21.08,31.75 38.86,31.75 41.4,29.21 IC4.2
N$100
  pour Top: 0,0 100.33,0 100.33,80.01 0,80.01
N$200
  pour Bottom: 0,0 100.33,0 100.33,80.01 0,80.01
NMI
  Top 0.254: IC3.17 16,35.56 8.89,28.45 TOP.11
RD*  (via drill 0.61)
  Top 0.254: IC5.3 67.82,31.75 v70.36,29.21 | v54.1,20.57 47.75,20.57 44.2,24.13 IC4.4
  Bottom 0.254: IC3.21 38.35,27.94 42.16,24.13 IC4.4 | v70.36,29.21 70.36,24.89 68.58,23.11 56.64,23.11 v54.1,20.57
RESET*  (via drill 0.61)
  Top 0.254: v39.62,16.51 39.62,19.05 30.99,27.69 30.99,39.12 32.51,40.64 IC3.26
  Bottom 0.254: v39.62,16.51 IC4.7 | TOP.16 16.26,49.02 16.51,49.28 22.86,49.28 31.75,40.39 32.77,40.39 IC3.26
VCC  (via drill 0.61)
  Top 0.254: IC5.28 | IC2.32 65.02,76.2 66.04,77.22 81.53,77.22 IC1.28 | v23.88,14.73 19.05,19.56 v16.51,19.56 | QG1.14 26.42,20.32 21.34,25.4 | 21.34,25.4 19.81,26.92 8.64,26.92 7.62,27.94 7.62,39.37 6.35,40.64 TOP.19 | 21.34,25.4 v21.34,29.46 | v85.85,35.31 84.07,35.31 IC5.28
  Bottom 0.254: v23.88,14.73 25.4,14.73 C6.1 | 52.58,31.75 IC4.24 50.29,31.75 46.74,28.19 41.15,28.19 39.88,29.46 v21.34,29.46 | 52.58,31.75 55.63,31.75 C3.1 | C1.1 23.88,76.2 v22.35,76.2 21.59,76.2 20.57,77.22 16.51,77.22 16,76.71 16,57.66 | IC5.28 81.53,36.83 80.26,35.56 76.45,35.56 C5.1 76.2,35.56 76.2,28.19 68.58,20.57 56.13,20.57 53.59,18.03 49.53,18.03 49.02,18.54 49.02,22.1 50.04,23.11 52.07,23.11 52.58,23.62 52.58,31.75 | IC2.32 56.64,76.2 | 56.64,76.2 52.32,76.2 C2.1 | C4.1 75.18,76.2 IC1.28 89.66,69.09 89.66,61.21 96.27,54.61 96.27,41.4 93.98,39.12 92.96,39.12 91.69,37.85 88.39,37.85 v85.85,35.31 | 16,57.66 16,52.58 IC3.11 | 16,57.66 8.89,50.55 TOP.3 8.89,50.29 5.84,50.29 5.08,49.53 5.08,39.37 | IC2.30 56.64,72.9 56.64,76.2 | v16.51,19.56 8.89,27.18 7.87,27.18 6.6,28.45 5.84,28.45 5.08,29.21 5.08,39.37 | 5.08,39.37 6.35,40.64 TOP.19
WAIT*
  Bottom 0.254: IC3.24 22.61,35.56 19.05,39.12 16.26,39.12 9.14,46.23 6.35,46.23 TOP.17
WR*  (via drill 0.61)
  Top 0.254: 34.8,28.96 33.27,30.48 IC3.22 | 34.8,28.96 v39.62,24.13 | v37.34,35.56 37.34,31.5 34.8,28.96
  Bottom 0.254: IC4.5 42.16,21.59 v39.62,24.13 | IC5.2 64.52,34.29 60.71,30.48 57.4,30.48 56.9,30.99 56.9,33.02 56.13,33.78 44.2,33.78 43.69,33.27 40.13,33.27 37.85,35.56 v37.34,35.56